# Altium schematic sheet Memory.SchDoc
size A4
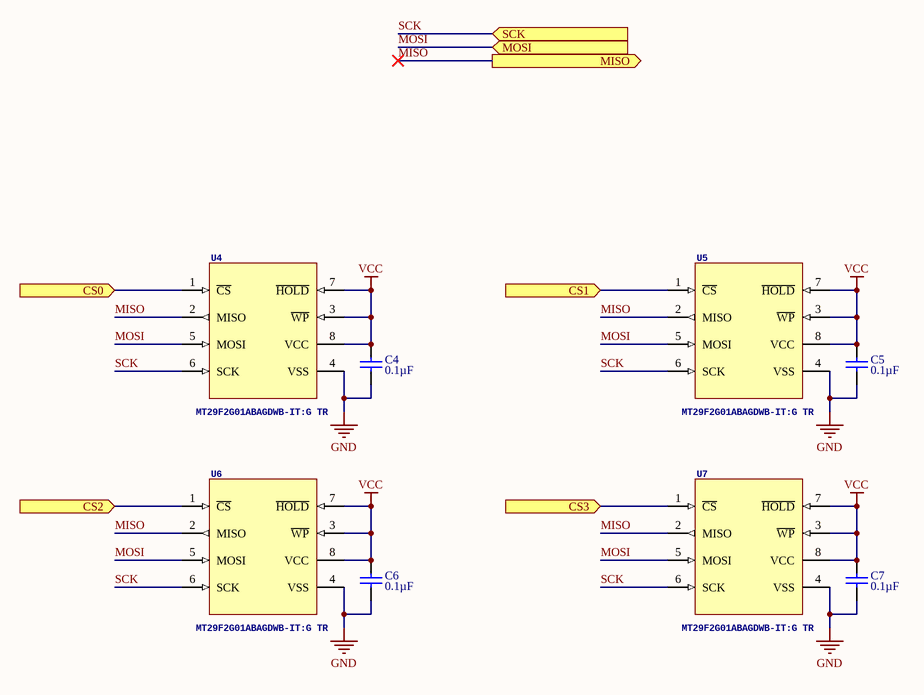
[diagram p0: Memory.SchDoc]

## Parts
C4  Capacitance: 0.1µF  [C0603N]  (hidden comment: CL10B104KO8NFNC)
C5  Capacitance: 0.1µF  [C0603N]  (hidden comment: CL10B104KO8NFNC)
C6  Capacitance: 0.1µF  [C0603N]  (hidden comment: CL10B104KO8NFNC)
C7  Capacitance: 0.1µF  [C0603N]  (hidden comment: CL10B104KO8NFNC)
U4  MT29F2G01ABAGDWB-IT:G TR  [8-UDFN-MT29F]
U5  MT29F2G01ABAGDWB-IT:G TR  [8-UDFN-MT29F]
U6  MT29F2G01ABAGDWB-IT:G TR  [8-UDFN-MT29F]
U7  MT29F2G01ABAGDWB-IT:G TR  [8-UDFN-MT29F]

## Ports
CS0 (in), CS1 (in), CS2 (in), CS3 (in), MISO (out), MOSI (in), SCK (in)

## Nets
GND: C4.2 C5.2 C6.2 C7.2 U4.4(VSS) U5.4(VSS) U6.4(VSS) U7.4(VSS)
VCC: C4.1 C5.1 C6.1 C7.1 U4.3(~{WP}) U4.7(~{HOLD}) U4.8(VCC) U5.3(~{WP}) U5.7(~{HOLD}) U5.8(VCC) U6.3(~{WP}) U6.7(~{HOLD}) U6.8(VCC) U7.3(~{WP}) U7.7(~{HOLD}) U7.8(VCC)
CS0: U4.1(~{CS}) ; port CS0
CS1: U5.1(~{CS}) ; port CS1
CS2: U6.1(~{CS}) ; port CS2
CS3: U7.1(~{CS}) ; port CS3
MISO: U4.2(MISO) U5.2(MISO) U6.2(MISO) U7.2(MISO) ; port MISO
MOSI: U4.5(MOSI) U5.5(MOSI) U6.5(MOSI) U7.5(MOSI) ; port MOSI
SCK: U4.6(SCK) U5.6(SCK) U6.6(SCK) U7.6(SCK) ; port SCK

## Library data of the parts
C4-C7 = CAPACITOR_NP: HOUSEPART: NO; POPULATE: 1; TOLERANCE: ±10%; VOLTAGE: 16V; Temperature Coefficient: X7R; DeviceName: CL10B104KO8NFNC; LibraryName: MF_Passives; DeviceSetName: CAPACITOR_NP; MPN: CL10B104KO8NFNC; URL: https://octopart.com/cl10b104ko8nfnc-samsung-19831587; MF_PARTNUM: CL10B104KO8NFNC
U4-U7 = MT29F2G01ABAGDWB-IT:G TR: IC Flash 2GB (UDFN8); Manufacturer_Name: Micron; SymbolName_1: MT29F2G01ABAGDWB-IT:G TR; DeviceName: IC Flash 2GB (UDFN8); LibraryName: MT29F2G01ABAGDWB-IT:G TR; DeviceSetName: MT29F2G01ABAGDWB-IT:G TR; Manufacturer_Part_Number: MT29F2G01ABAGDWB-IT:G TR; Height: 0.65mm